# Altium schematic sheet S01.SchDoc: Quad Linear Amplifier
size 381 x 254 mm; Revision: 1.6; SheetNumber: 1; SheetTotal: 9
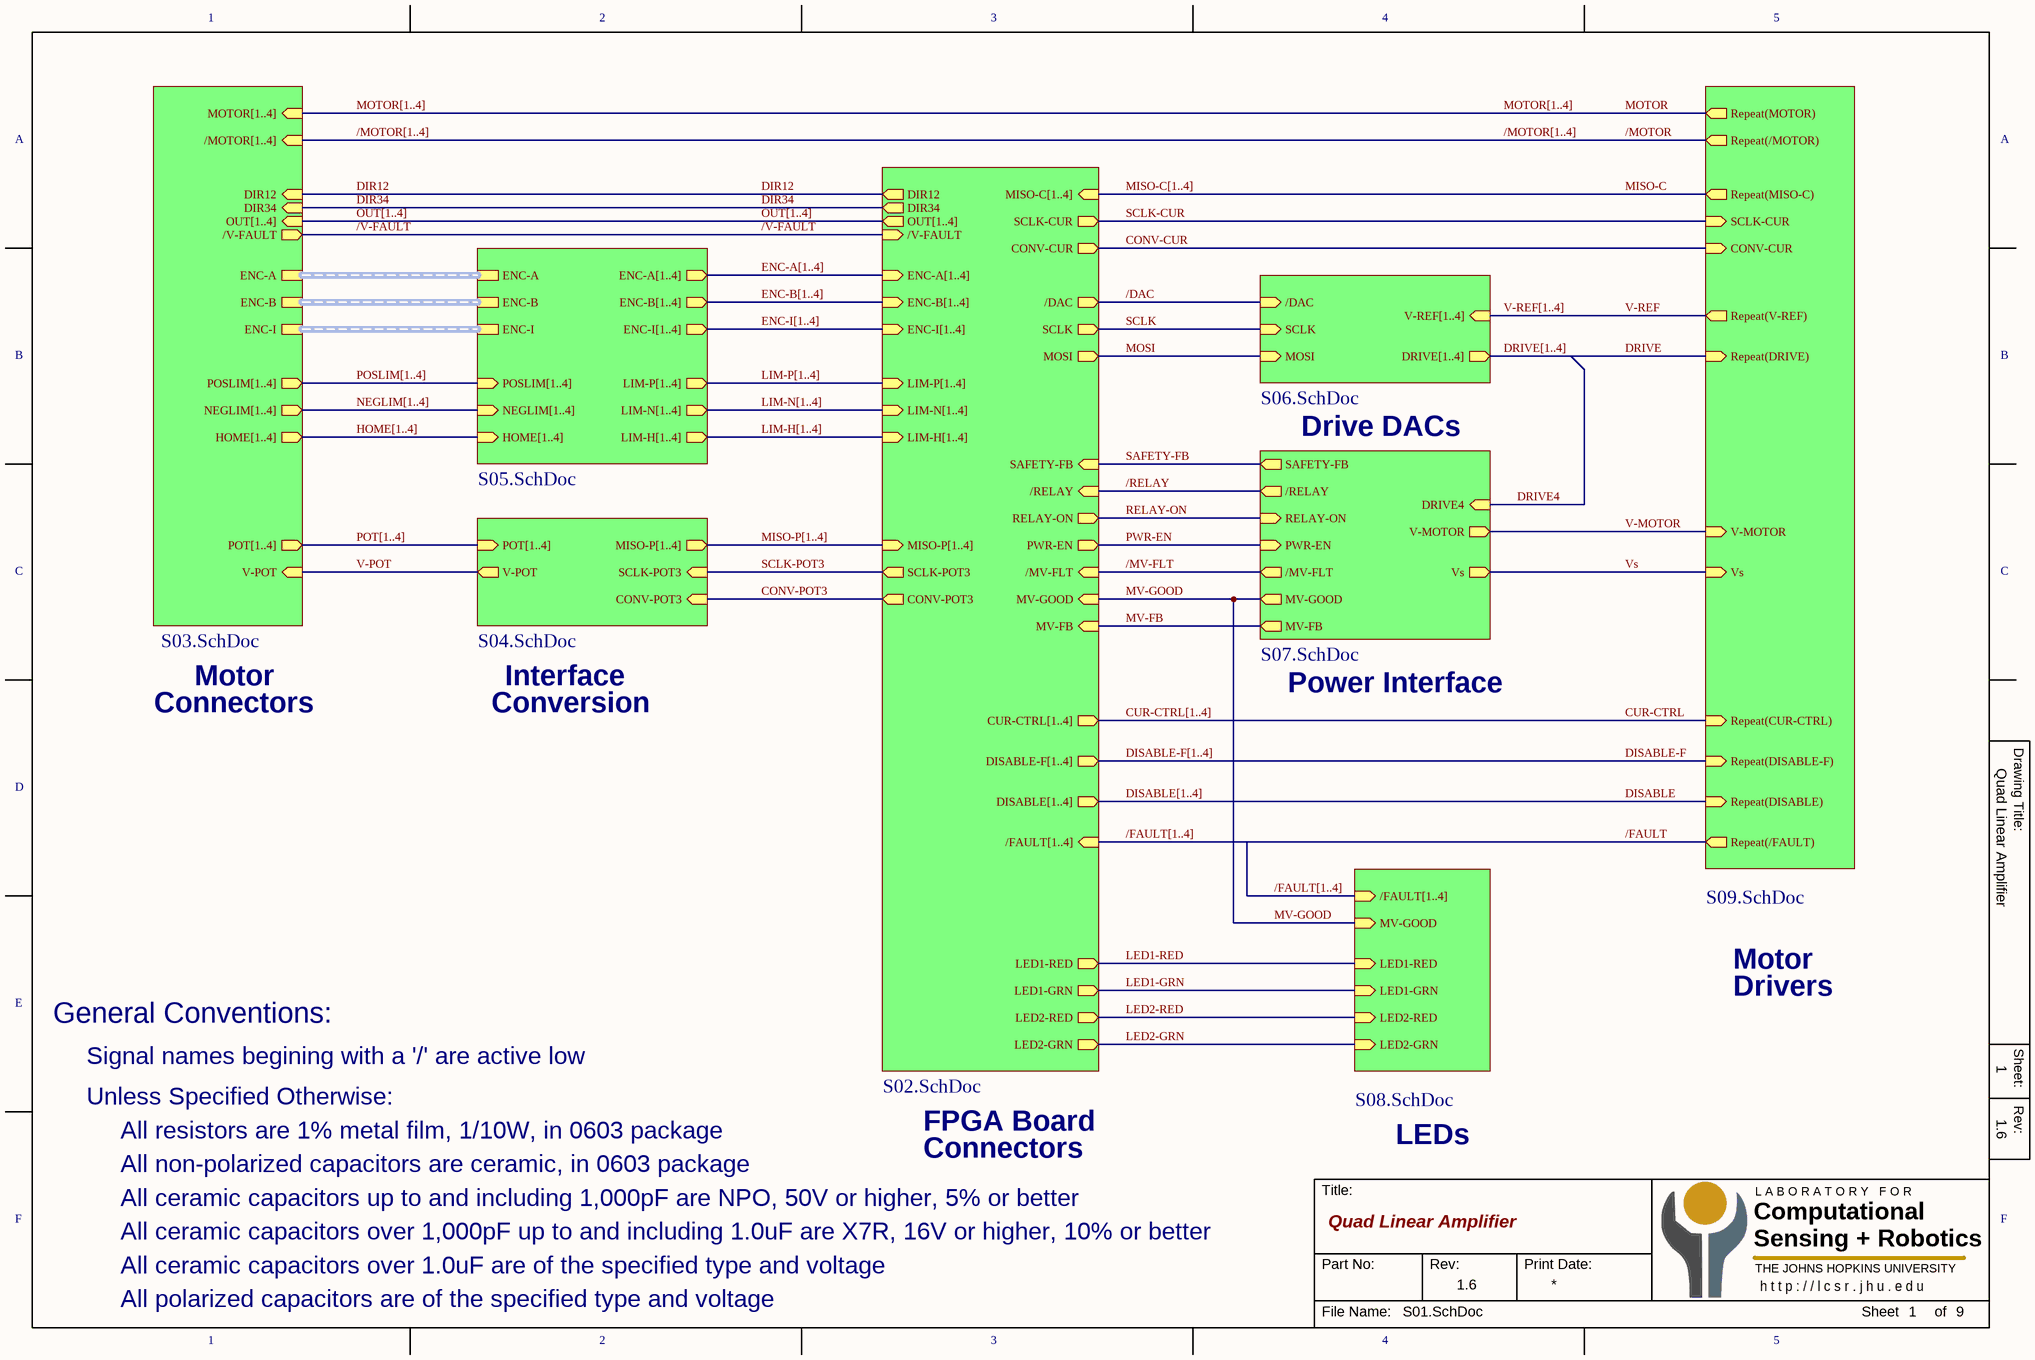
[diagram p0: S01.SchDoc]

## Sub-sheets
Repeat(U_S09,1,4) = S09.SchDoc: Repeat(/MOTOR) (out), Repeat(MOTOR) (out), Repeat(DRIVE) (in), V-MOTOR (in), Repeat(DISABLE) (in), Repeat(/FAULT) (out), CONV-CUR (in), SCLK-CUR (in), Repeat(MISO-C) (out), Repeat(DISABLE-F) (in), Repeat(CUR-CTRL) (in), Vs (in), Repeat(V-REF) (out)
U_S02 = S02.SchDoc: /FAULT[1..4] (in), DISABLE[1..4] (out), LIM-P[1..4] (in), LIM-N[1..4] (in), LIM-H[1..4] (in), ENC-A[1..4] (in), ENC-B[1..4] (in), ENC-I[1..4] (in), OUT[1..4] (out), CONV-POT3 (out), SCLK-POT3 (out), MISO-P[1..4] (in), CONV-CUR (out), SCLK-CUR (out), MISO-C[1..4] (in), PWR-EN (out), MV-GOOD (in), /DAC (out), SCLK (out), MOSI (out), /V-FAULT (in), RELAY-ON (out), /RELAY (in), LED2-GRN (out), LED2-RED (out), LED1-GRN (out), LED1-RED (out), DIR34 (out), DIR12 (out), /MV-FLT (in), CUR-CTRL[1..4] (out), MV-FB (in), SAFETY-FB (in), DISABLE-F[1..4] (out)
U_S03 = S03.SchDoc: OUT[1..4] (in), POSLIM[1..4] (out), NEGLIM[1..4] (out), HOME[1..4] (out), POT[1..4] (out), V-POT (in), /MOTOR[1..4] (in), MOTOR[1..4] (in), ENC-A (harness ENC-A), ENC-B (harness ENC-B), ENC-I (harness ENC-I), /V-FAULT (out), DIR34 (in), DIR12 (in)
U_S04 = S04.SchDoc: CONV-POT3 (in), SCLK-POT3 (in), MISO-P[1..4] (out), V-POT (out), POT[1..4] (in)
U_S05 = S05.SchDoc: ENC-A[1..4] (out), ENC-B[1..4] (out), ENC-I[1..4] (out), ENC-A (harness ENC-A), ENC-B (harness ENC-B), ENC-I (harness ENC-I), POSLIM[1..4] (in), NEGLIM[1..4] (in), HOME[1..4] (in), LIM-P[1..4] (out), LIM-N[1..4] (out), LIM-H[1..4] (out)
U_S06 = S06.SchDoc: DRIVE[1..4] (out), /DAC (in), SCLK (in), MOSI (in), V-REF[1..4] (in)
U_S07 = S07.SchDoc: V-MOTOR (out), PWR-EN (in), MV-GOOD (out), RELAY-ON (in), /RELAY (out), /MV-FLT (out), MV-FB (out), SAFETY-FB (out), Vs (out), DRIVE4 (in)
U_S09 = S08.SchDoc: /FAULT[1..4] (in), MV-GOOD (in), LED2-GRN (in), LED2-RED (in), LED1-GRN (in), LED1-RED (in)

## Nets
/DAC: sheet U_S02//DAC, sheet U_S06//DAC
/FAULT: sheet Repeat(U_S09,1,4)/Repeat(/FAULT)
/MOTOR: sheet Repeat(U_S09,1,4)/Repeat(/MOTOR)
/MV-FLT: sheet U_S02//MV-FLT, sheet U_S07//MV-FLT
/RELAY: sheet U_S02//RELAY, sheet U_S07//RELAY
/V-FAULT: sheet U_S02//V-FAULT, sheet U_S03//V-FAULT
CONV-CUR: sheet U_S02/CONV-CUR, sheet Repeat(U_S09,1,4)/CONV-CUR
CONV-POT3: sheet U_S02/CONV-POT3, sheet U_S04/CONV-POT3
CUR-CTRL: sheet Repeat(U_S09,1,4)/Repeat(CUR-CTRL)
DIR12: sheet U_S02/DIR12, sheet U_S03/DIR12
DIR34: sheet U_S02/DIR34, sheet U_S03/DIR34
DISABLE: sheet Repeat(U_S09,1,4)/Repeat(DISABLE)
DISABLE-F: sheet Repeat(U_S09,1,4)/Repeat(DISABLE-F)
DRIVE: sheet Repeat(U_S09,1,4)/Repeat(DRIVE)
DRIVE4: sheet U_S07/DRIVE4
LED1-GRN: sheet U_S02/LED1-GRN, sheet U_S09/LED1-GRN
LED1-RED: sheet U_S02/LED1-RED, sheet U_S09/LED1-RED
LED2-GRN: sheet U_S02/LED2-GRN, sheet U_S09/LED2-GRN
LED2-RED: sheet U_S02/LED2-RED, sheet U_S09/LED2-RED
MISO-C: sheet Repeat(U_S09,1,4)/Repeat(MISO-C)
MOSI: sheet U_S02/MOSI, sheet U_S06/MOSI
MOTOR: sheet Repeat(U_S09,1,4)/Repeat(MOTOR)
MV-FB: sheet U_S02/MV-FB, sheet U_S07/MV-FB
MV-GOOD: sheet U_S02/MV-GOOD, sheet U_S07/MV-GOOD, sheet U_S09/MV-GOOD
PWR-EN: sheet U_S02/PWR-EN, sheet U_S07/PWR-EN
RELAY-ON: sheet U_S02/RELAY-ON, sheet U_S07/RELAY-ON
SAFETY-FB: sheet U_S02/SAFETY-FB, sheet U_S07/SAFETY-FB
SCLK: sheet U_S02/SCLK, sheet U_S06/SCLK
SCLK-CUR: sheet U_S02/SCLK-CUR, sheet Repeat(U_S09,1,4)/SCLK-CUR
SCLK-POT3: sheet U_S02/SCLK-POT3, sheet U_S04/SCLK-POT3
V-MOTOR: sheet Repeat(U_S09,1,4)/V-MOTOR, sheet U_S07/V-MOTOR
V-POT: sheet U_S03/V-POT, sheet U_S04/V-POT
V-REF: sheet Repeat(U_S09,1,4)/Repeat(V-REF)
Vs: sheet Repeat(U_S09,1,4)/Vs, sheet U_S07/Vs

## Buses and harness runs
bus /FAULT[1..4] = sheet U_S02//FAULT[1..4] = sheet U_S09//FAULT[1..4]
bus /MOTOR[1..4] = sheet U_S03//MOTOR[1..4]
bus CUR-CTRL[1..4] = sheet U_S02/CUR-CTRL[1..4]
bus DISABLE-F[1..4] = sheet U_S02/DISABLE-F[1..4]
bus DISABLE[1..4] = sheet U_S02/DISABLE[1..4]
bus DRIVE[1..4] = sheet U_S06/DRIVE[1..4]
bus ENC-A[1..4] = sheet U_S02/ENC-A[1..4] = sheet U_S05/ENC-A[1..4]
bus ENC-B[1..4] = sheet U_S02/ENC-B[1..4] = sheet U_S05/ENC-B[1..4]
bus ENC-I[1..4] = sheet U_S02/ENC-I[1..4] = sheet U_S05/ENC-I[1..4]
bus HOME[1..4] = sheet U_S03/HOME[1..4] = sheet U_S05/HOME[1..4]
bus LIM-H[1..4] = sheet U_S02/LIM-H[1..4] = sheet U_S05/LIM-H[1..4]
bus LIM-N[1..4] = sheet U_S02/LIM-N[1..4] = sheet U_S05/LIM-N[1..4]
bus LIM-P[1..4] = sheet U_S02/LIM-P[1..4] = sheet U_S05/LIM-P[1..4]
bus MISO-C[1..4] = sheet U_S02/MISO-C[1..4]
bus MISO-P[1..4] = sheet U_S02/MISO-P[1..4] = sheet U_S04/MISO-P[1..4]
bus MOTOR[1..4] = sheet U_S03/MOTOR[1..4]
bus NEGLIM[1..4] = sheet U_S03/NEGLIM[1..4] = sheet U_S05/NEGLIM[1..4]
bus OUT[1..4] = sheet U_S02/OUT[1..4] = sheet U_S03/OUT[1..4]
bus POSLIM[1..4] = sheet U_S03/POSLIM[1..4] = sheet U_S05/POSLIM[1..4]
bus POT[1..4] = sheet U_S03/POT[1..4] = sheet U_S04/POT[1..4]
bus V-REF[1..4] = sheet U_S06/V-REF[1..4]
harness sheet U_S03/ENC-A = sheet U_S05/ENC-A
harness sheet U_S03/ENC-B = sheet U_S05/ENC-B
harness sheet U_S03/ENC-I = sheet U_S05/ENC-I

## Notes on the sheet
- Drive DACs
- Motor
- Interface
- Power Interface
- Connectors
- Conversion
- General Conventions:
- Drivers
- Signal names begining with a '/' are active low
- Unless Specified Otherwise:
- All resistors are 1% metal film, 1/10W, in 0603 package
- All non-polarized capacitors are ceramic, in 0603 package
- FPGA Board
- LEDs
- All ceramic capacitors up to and including 1,000pF are NPO, 50V or higher, 5% or better
- All ceramic capacitors over 1,000pF up to and including 1.0uF are X7R, 16V or higher, 10% or better
- All ceramic capacitors over 1.0uF are of the specified type and voltage
- All polarized capacitors are of the specified type and voltage
- 1
- 2
- 3
- 4
- 5
- A
- B
- C
- Drawing Title:
- D
- E
- Sheet:
- Rev:
- F
- Title:
- Computational
- Sensing + Robotics
- L A B O R A T O R Y   F O R
- Part No:
- Print Date:
- THE JOHNS HOPKINS UNIVERSITY
- h t t p : / / l c s r . j h u . e d u
- File Name:
- Sheet
- of